# EasyEDA schematic DAAP.json
TITLE: Distributeur Automatique\nd'argent de poche; REV: 1.0; Date: 2019-05-16; Sheet: 1/1; Drawn By: PhaustSceptic; Company: -
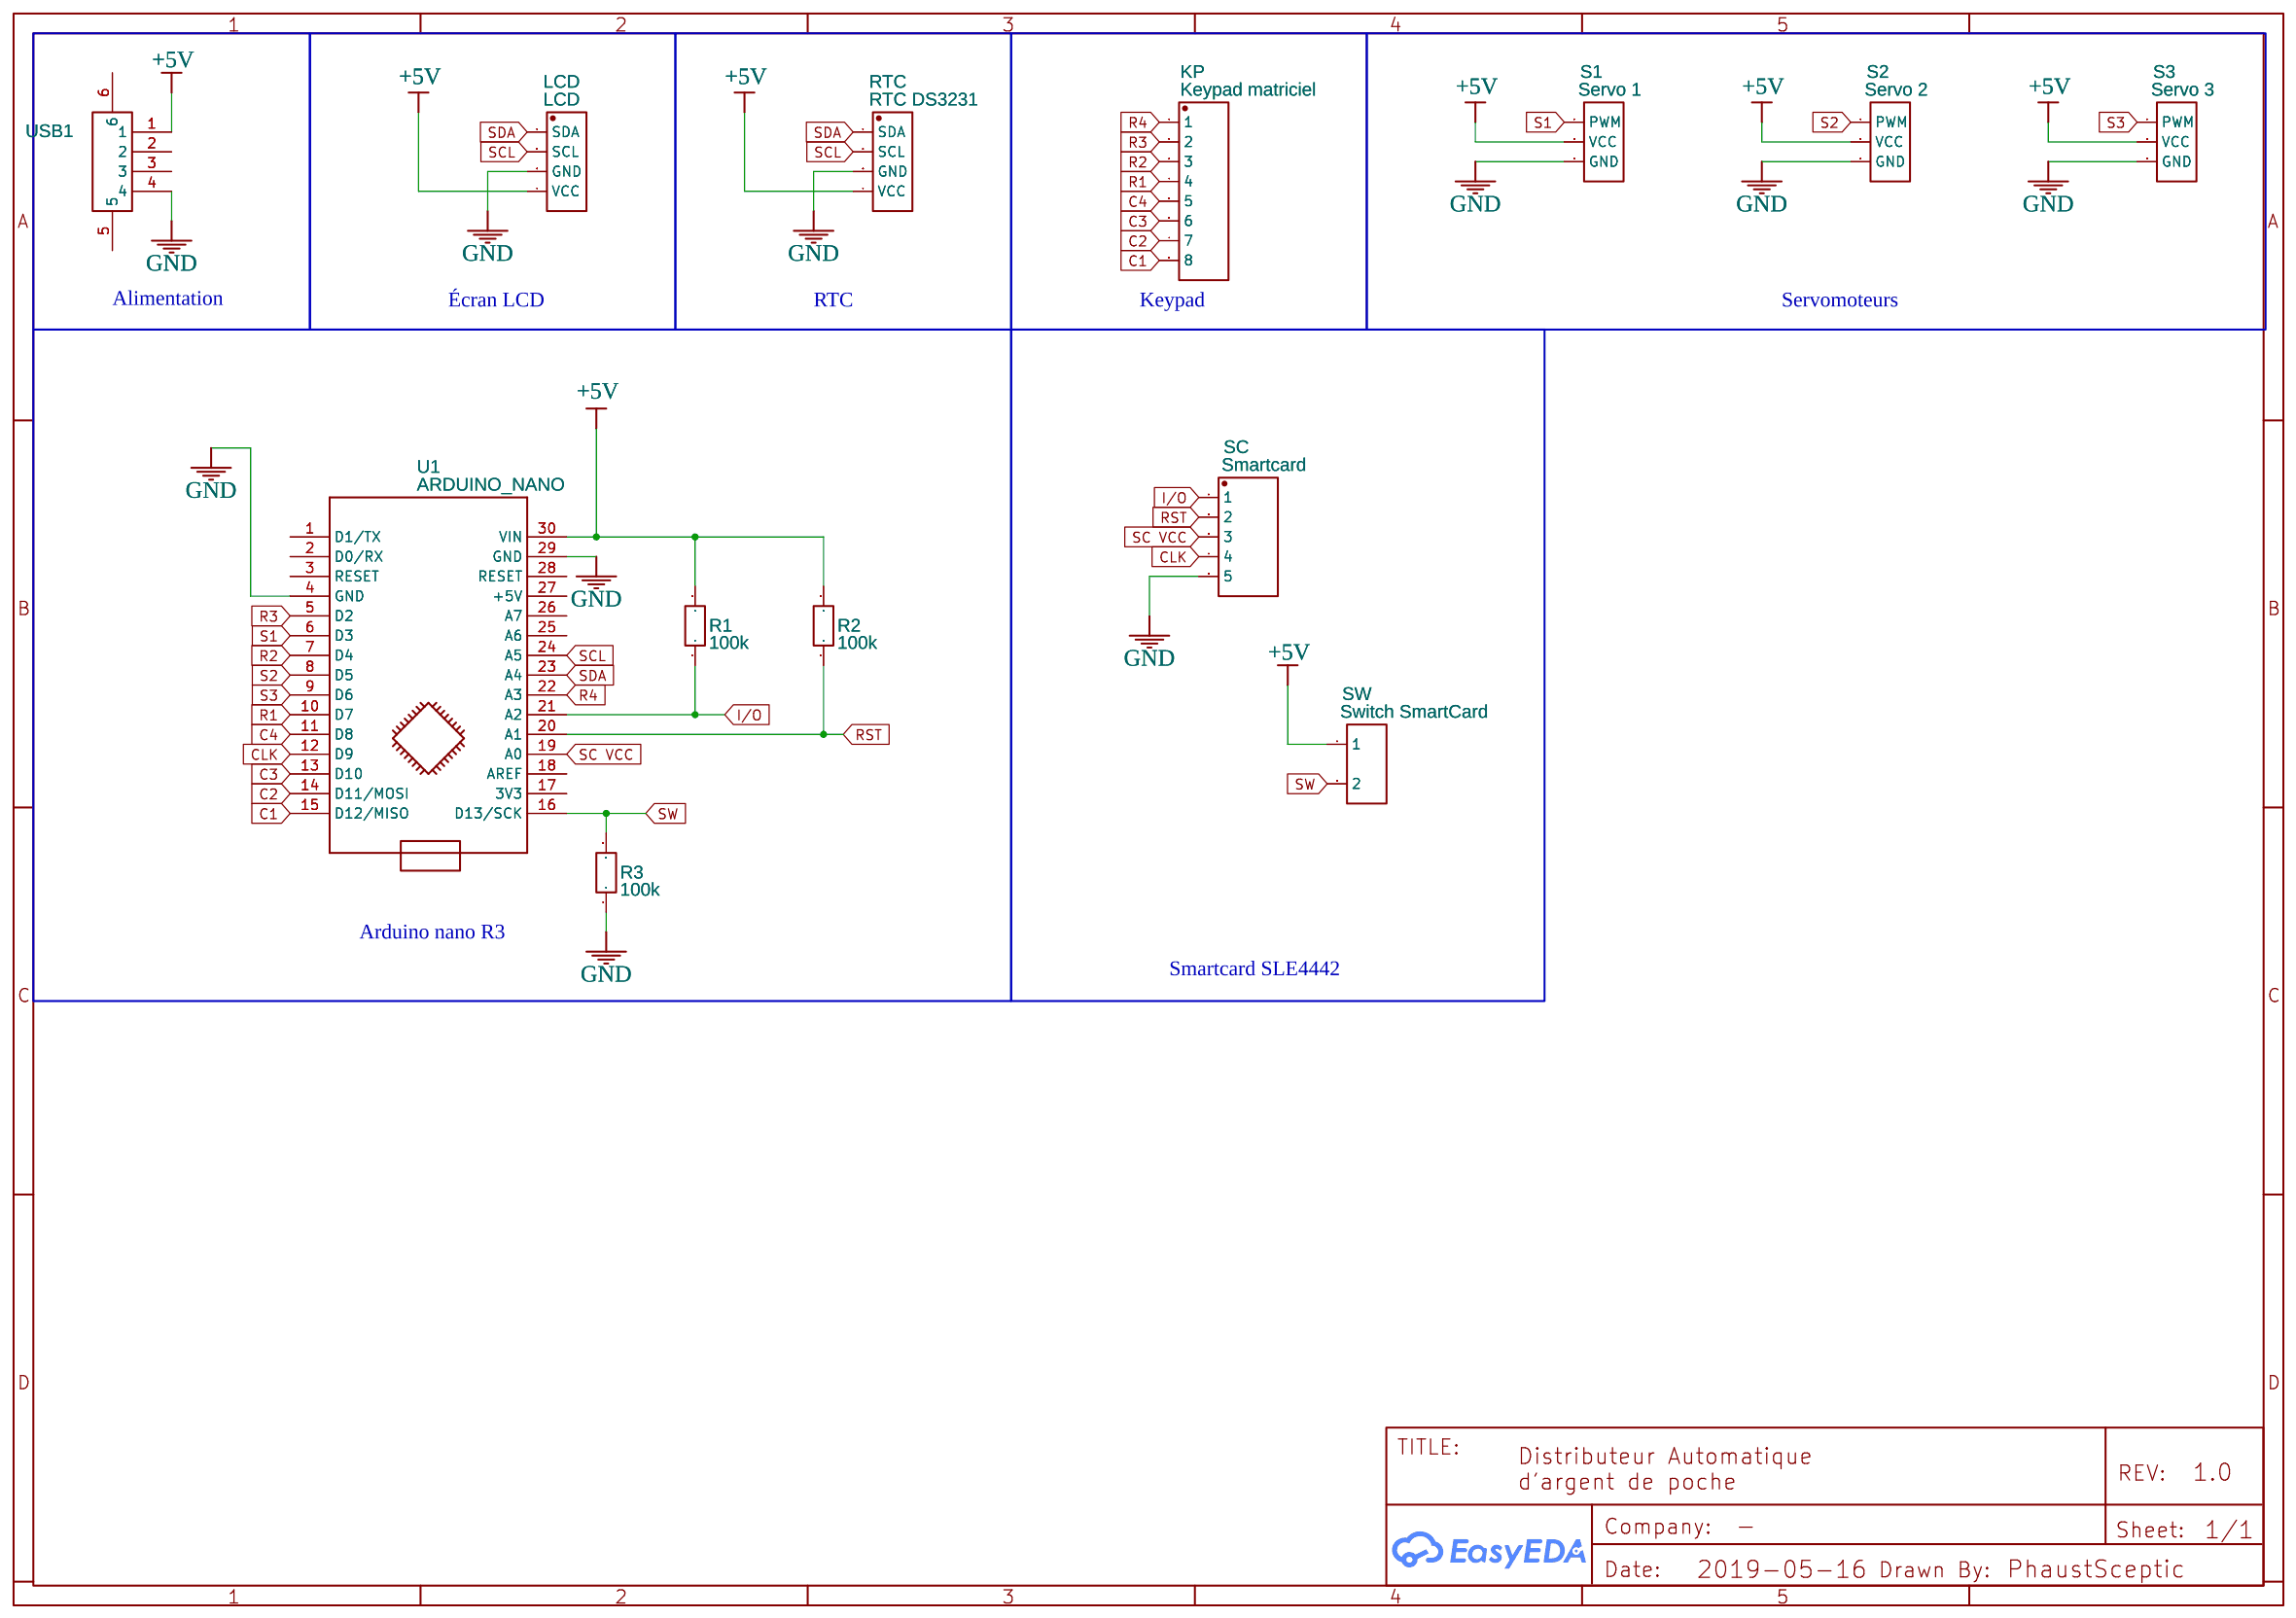
[diagram p0: schematic sheet]

## Parts
KP  Keypad matriciel  [210S-1X8P]
LCD  LCD  [DIP-1X4P-2.54MM-M]
R1  100k  [AXIAL-0.3]
R2  100k  [AXIAL-0.3]
R3  100k  [AXIAL-0.3]
RTC  RTC DS3231  [DIP-1X4P-2.54MM-M]
S1  Servo 1  [HDR-3X1/2.54]
S2  Servo 2  [HDR-3X1/2.54]
S3  Servo 3  [HDR-3X1/2.54]
SC  Smartcard  [DIP-1X5P-2.54MM-M]
SW  Switch SmartCard  [HDR-2X1/2.54]
U1  ARDUINO_NANO  [ARDUINO_NANO]
USB1  USB-AF-90-14.4X13.6-H7.0-DIP  [USB-A-F-90-14.4X13.6-H7.00]

## Library data of the parts
KP = -: Supplier: LCSC; Manufacturer: Ckmtw; Manufacturer Part: 210S-1*8P L=11.6MMGold-plated black; Contributor: LCSC; Supplier Part: C124381
LCD RTC = -: Supplier: LCSC; Manufacturer: Ckmtw; Manufacturer Part: 210S-1*4P L=11.6MMGold-plated black; Contributor: LCSC; Supplier Part: C124378
R1-R3 = Res_AXIAL-0.3(1/8W)_EU: Manufacturer Part: ?
S1-S3 = -: Supplier: LCSC; Manufacturer: BOOMELE; Manufacturer Part: Header2.54mm 1*3P; image: //image.lceda.cn/szlcsc/C49257.jpg; Supplier Part: C49257
SC = -: Supplier: LCSC; Manufacturer: Ckmtw; Manufacturer Part: 210S-1*5P L=11.6MMGold-plated black; Contributor: LCSC; Supplier Part: C124379
SW = -: Supplier: LCSC; Manufacturer: TE Connectivity; Manufacturer Part: 826629-2; image: //image.lceda.cn/szlcsc/C86471.jpg; Supplier Part: C86471
U1 = -: sourceId: KGSeAWhDB; Manufacturer Part: ?
USB1 = -: Supplier: LCSC; Supplier Part: C46407; Manufacturer: LCSC; Contributor: LCSC

## Nets
+5V: LCD.4(VCC) R1.2 R2.2 RTC.4(VCC) S1.2(VCC) S2.2(VCC) S3.2(VCC) SW.1 U1.30(VIN) USB1.1
GND: LCD.3(GND) R3.1 RTC.3(GND) S1.3(GND) S2.3(GND) S3.3(GND) SC.5 U1.4(GND) U1.29(GND) USB1.4
C1: KP.8 U1.15(D12/MISO)
C2: KP.7 U1.14(D11/MOSI)
C3: KP.6 U1.13(D10)
C4: KP.5 U1.11(D8)
CLK: SC.4 U1.12(D9)
I/O: R1.1 SC.1 U1.21(A2)
R1: KP.4 U1.10(D7)
R2: KP.3 U1.7(D4)
R3: KP.2 U1.5(D2)
R4: KP.1 U1.22(A3)
RST: R2.1 SC.2 U1.20(A1)
S1: S1.1(PWM) U1.6(D3)
S2: S2.1(PWM) U1.8(D5)
S3: S3.1(PWM) U1.9(D6)
SC VCC: SC.3 U1.19(A0)
SCL: LCD.2(SCL) RTC.2(SCL) U1.24(A5)
SDA: LCD.1(SDA) RTC.1(SDA) U1.23(A4)
SW: R3.2 SW.2 U1.16(D13/SCK)

Not connected (* = marked no-connect by the designer): U1 1(D1/TX) 2(D0/RX) 3(RESET) 17(3V3) 18(AREF) 25(A6) 26(A7) 27(+5V) 28(RESET); USB1 2 3 5 6

## Notes on the sheet
- Alimentation
- Écran LCD
- RTC
- Keypad
- Servomoteurs
- Arduino nano R3
- Smartcard SLE4442
